# EAGLE schematic Schematic_v1.1 (EAGLE 9.7.0)
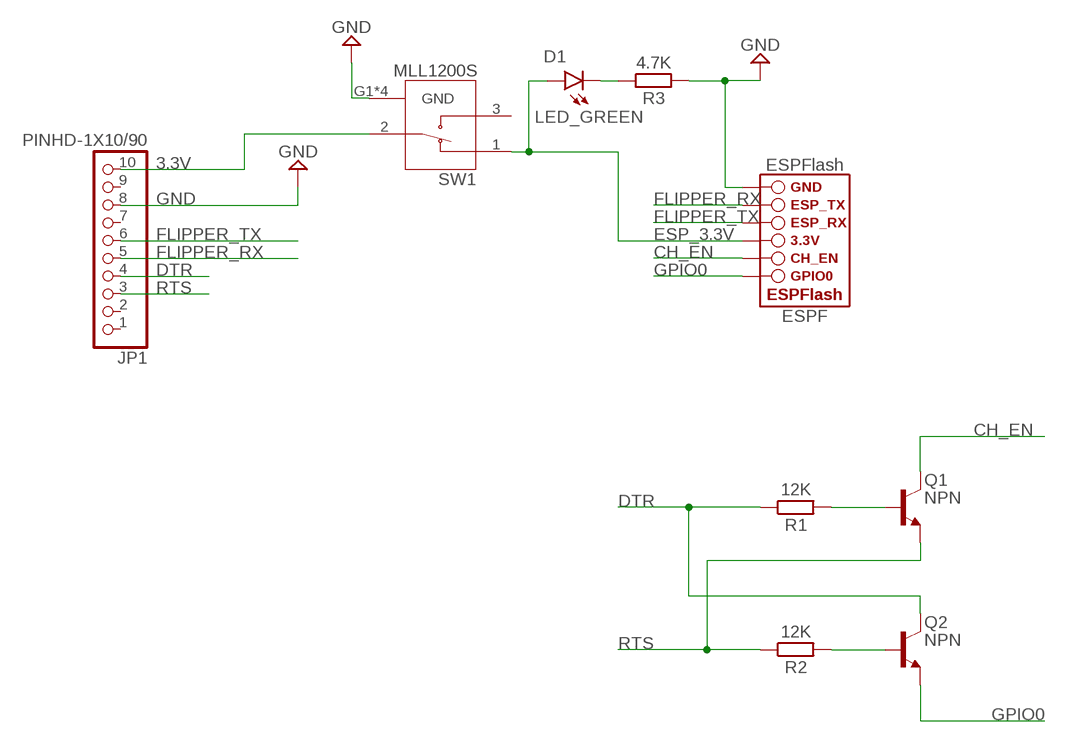
[diagram p0: schematic, sheet 1]

## Parts
D1  LED_GREEN  CHIP-FLAT-B_0603-0.55MM  [LEDC1608X55N_FLAT-B]
ESPF  ESPFLASH-1X6-2.54-PLAIN  [1X6-2.54-PLAIN]
JP1  PINHD-1X10/90  [1X10/90]
Q1  NPN  NPN_SOT23-BEC  [SOT95P237X112-3N]
Q2  NPN  NPN_SOT23-BEC  [SOT95P237X112-3N]
R1  12K  R_CHIP-0603(1608-METRIC)  [RESC1608X60]
R2  12K  R_CHIP-0603(1608-METRIC)  [RESC1608X60]
R3  4.7K  R_CHIP-0603(1608-METRIC)  [RESC1608X60]
SW1  MLL1200S  [SW_MLL1200S]

## Nets
3.3V [Power]: JP1.10 SW1.2
CH_EN: ESPF.5(CH_EN) Q1.3(C)
DTR: JP1.4 Q2.3(C) R1.1
ESP_3.3V [Power]: D1.A ESPF.4(3.3V) SW1.1
FLIPPER_RX: ESPF.2(ESP_TX) JP1.5
FLIPPER_TX: ESPF.3(ESP_RX) JP1.6
GND [Power]: ESPF.1(GND) JP1.8 R3.2 SW1.G1(GND) SW1.G2(GND) SW1.G3(GND) SW1.G4(GND)
GPIO0: ESPF.6(GPIO0) Q2.2(E)
N$1: D1.C R3.1
N$3: Q1.1(B) R1.2
N$5: Q2.1(B) R2.2
RTS: JP1.3 Q1.2(E) R2.1
Unconnected: JP1.1 JP1.2 JP1.7 JP1.9 SW1.3

## Library data of the parts
D1 = LED:CHIP-FLAT-B; CATEGORY: LED; COLOR: BLUE; DESCRIPTION: CHIP LED FLAT; SUB-CATEGORY: CHIP; TYPE: FLAT_TOP; VALUE: LED_BLUE
ESPF = SuperHouse-ESPFlash:ESPFLASH: ESPFlash ESPFlash programming header for ESP8266, ESP8285, and ESP32. Options for both 1x6 and 2x3 formats, in both 2.54mm (0.1") and 1.27mm (0.05") pitch.
JP1 = Connector:PINHD-1X10: PIN HEADER; CATEGORY: CONNECTOR; SUB-CATEGORY: PIN-HEADER
Q1 Q2 = Transistor:NPN: NPN - Generic; CATEGORY: Transistor; SUB-CATEGORY: BJT; TYPE: NPN
R1-R3 = Resistor:R: Resistor Fixed - Generic; CATEGORY: Resistor; SUB-CATEGORY: Fixed
SW1 = MLL1200S:MLL1200S: Switch Slide SPDT Side Slide 0.3A 4VDC Gull Wing SMD Box; COMMENT: 1437575-1

## Net classes
0 default: width 0.254 mm
1 Power: width 0.508 mm